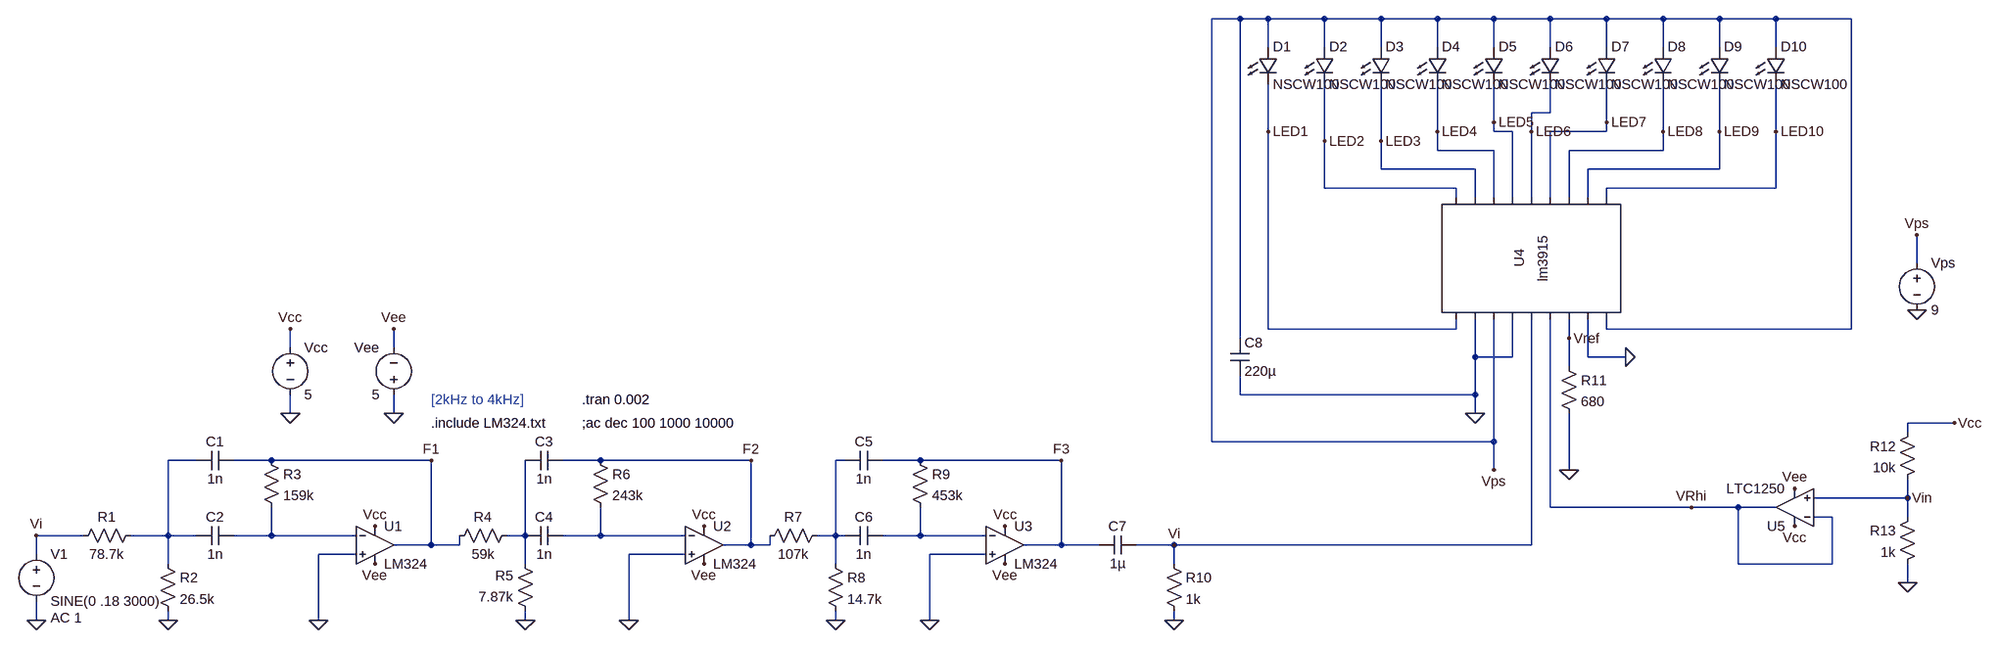
[diagram p0: schematic FinalUpperMidrangeFilterWithLEDDriver.asc]
FinalUpperMidrangeFilterWithLEDDriver.asc, the LTspice schematic file:
Version 4
SHEET 1 2840 680
WIRE 1568 -736 1520 -736
WIRE 1616 -736 1568 -736
WIRE 1712 -736 1616 -736
WIRE 1808 -736 1712 -736
WIRE 1904 -736 1808 -736
WIRE 2000 -736 1904 -736
WIRE 2096 -736 2000 -736
WIRE 2192 -736 2096 -736
WIRE 2288 -736 2192 -736
WIRE 2384 -736 2288 -736
WIRE 2480 -736 2384 -736
WIRE 2608 -736 2480 -736
WIRE 1616 -688 1616 -736
WIRE 1712 -688 1712 -736
WIRE 1808 -688 1808 -736
WIRE 1904 -688 1904 -736
WIRE 2000 -688 2000 -736
WIRE 2096 -688 2096 -736
WIRE 2192 -688 2192 -736
WIRE 2288 -688 2288 -736
WIRE 2384 -688 2384 -736
WIRE 2480 -688 2480 -736
WIRE 2096 -576 2096 -624
WIRE 2096 -576 2064 -576
WIRE 2000 -560 2000 -624
WIRE 2192 -560 2192 -624
WIRE 1616 -544 1616 -624
WIRE 1904 -544 1904 -624
WIRE 2000 -544 2000 -560
WIRE 2032 -544 2000 -544
WIRE 2064 -544 2064 -576
WIRE 2192 -544 2192 -560
WIRE 2192 -544 2096 -544
WIRE 2288 -544 2288 -624
WIRE 2384 -544 2384 -624
WIRE 2480 -544 2480 -624
WIRE 1712 -528 1712 -624
WIRE 1808 -528 1808 -624
WIRE 1904 -512 1904 -544
WIRE 2000 -512 1904 -512
WIRE 2288 -512 2288 -544
WIRE 2288 -512 2128 -512
WIRE 1808 -480 1808 -528
WIRE 1968 -480 1808 -480
WIRE 2384 -480 2384 -544
WIRE 2384 -480 2160 -480
WIRE 1712 -448 1712 -528
WIRE 1936 -448 1712 -448
WIRE 2480 -448 2480 -544
WIRE 2480 -448 2192 -448
WIRE 1936 -432 1936 -448
WIRE 1968 -432 1968 -480
WIRE 2000 -432 2000 -512
WIRE 2032 -432 2032 -544
WIRE 2064 -432 2064 -544
WIRE 2096 -432 2096 -544
WIRE 2128 -432 2128 -512
WIRE 2160 -432 2160 -480
WIRE 2192 -432 2192 -448
WIRE 2720 -320 2720 -368
WIRE 1616 -208 1616 -544
WIRE 1936 -208 1936 -224
WIRE 1936 -208 1616 -208
WIRE 2192 -208 2192 -224
WIRE 2608 -208 2608 -736
WIRE 2608 -208 2192 -208
WIRE 1568 -192 1568 -736
WIRE 2128 -192 2128 -224
WIRE -48 -176 -48 -208
WIRE 128 -176 128 -208
WIRE 1968 -160 1968 -224
WIRE 2032 -160 2032 -224
WIRE 2032 -160 1968 -160
WIRE 2160 -160 2160 -224
WIRE 2224 -160 2160 -160
WIRE 2128 -144 2128 -192
WIRE 1568 -96 1568 -128
WIRE 1968 -96 1968 -160
WIRE 1968 -96 1568 -96
WIRE -48 -64 -48 -96
WIRE 128 -64 128 -96
WIRE 1968 -64 1968 -96
WIRE 2784 -48 2704 -48
WIRE 2704 -32 2704 -48
WIRE 1520 -16 1520 -736
WIRE 2000 -16 2000 -224
WIRE 2000 -16 1520 -16
WIRE -208 16 -256 16
WIRE -80 16 -144 16
WIRE 192 16 -80 16
WIRE 480 16 416 16
WIRE 736 16 480 16
WIRE 896 16 880 16
WIRE 1024 16 960 16
WIRE 1264 16 1024 16
WIRE 2000 32 2000 -16
WIRE 2128 32 2128 -64
WIRE 2704 80 2704 48
WIRE 2704 80 2544 80
WIRE 2096 96 2096 -224
WIRE 2336 96 2096 96
WIRE 2416 96 2336 96
WIRE 2480 96 2416 96
WIRE 2576 112 2544 112
WIRE 2704 112 2704 80
WIRE -400 144 -480 144
WIRE -256 144 -256 16
WIRE -256 144 -320 144
WIRE -208 144 -256 144
WIRE -80 144 -80 96
WIRE -80 144 -144 144
WIRE 64 144 -80 144
WIRE 352 144 352 16
WIRE 352 144 320 144
WIRE 480 144 480 96
WIRE 480 144 416 144
WIRE 624 144 480 144
WIRE 880 144 880 16
WIRE 880 144 848 144
WIRE 896 144 880 144
WIRE 1024 144 1024 96
WIRE 1024 144 960 144
WIRE 1136 144 1024 144
WIRE 192 160 192 16
WIRE 192 160 128 160
WIRE 240 160 240 144
WIRE 240 160 192 160
WIRE 736 160 736 16
WIRE 736 160 688 160
WIRE 768 160 768 144
WIRE 768 160 736 160
WIRE 1264 160 1264 16
WIRE 1264 160 1200 160
WIRE 1328 160 1264 160
WIRE 1456 160 1392 160
WIRE 2064 160 2064 -224
WIRE 2064 160 1456 160
WIRE -480 176 -480 144
WIRE 64 176 0 176
WIRE 624 176 528 176
WIRE 1136 176 1040 176
WIRE -256 192 -256 144
WIRE 352 192 352 144
WIRE 880 192 880 144
WIRE 1456 192 1456 160
WIRE 2416 192 2416 96
WIRE 2576 192 2576 112
WIRE 2576 192 2416 192
WIRE 2704 224 2704 192
WIRE -480 288 -480 256
WIRE -256 288 -256 272
WIRE 0 288 0 176
WIRE 352 288 352 272
WIRE 528 288 528 176
WIRE 880 288 880 272
WIRE 1040 288 1040 176
WIRE 1456 288 1456 272
FLAG 528 288 0
FLAG -480 288 0
FLAG 192 16 F1
FLAG 736 16 F2
FLAG -480 144 Vi
FLAG 1040 288 0
FLAG 1264 16 F3
FLAG 880 288 0
FLAG 352 288 0
FLAG -256 288 0
FLAG 0 288 0
FLAG -48 -208 Vcc
FLAG -48 -64 0
FLAG 128 -64 0
FLAG 128 -208 Vee
FLAG 96 192 Vee
FLAG 96 128 Vcc
FLAG 656 192 Vee
FLAG 656 128 Vcc
FLAG 1168 192 Vee
FLAG 1168 128 Vcc
FLAG 1456 288 0
FLAG 1456 160 Vi
FLAG 1968 -64 0
FLAG 2720 -240 0
FLAG 2720 -368 Vps
FLAG 2128 32 0
FLAG 2000 32 Vps
FLAG 1616 -544 LED1
FLAG 1712 -528 LED2
FLAG 1808 -528 LED3
FLAG 1904 -544 LED4
FLAG 2000 -560 LED5
FLAG 2064 -544 LED6
FLAG 2192 -560 LED7
FLAG 2288 -544 LED8
FLAG 2384 -544 LED9
FLAG 2480 -544 LED10
FLAG 2224 -160 0
FLAG 2128 -192 Vref
FLAG 2704 224 0
FLAG 2512 128 Vcc
FLAG 2704 80 Vin
FLAG 2336 96 VRhi
FLAG 2512 64 Vee
FLAG 2784 -48 Vcc
SYMBOL res -304 128 R90
WINDOW 0 0 56 VBottom 2
WINDOW 3 32 56 VTop 2
SYMATTR InstName R1
SYMATTR Value 78.7k
SYMBOL voltage -480 160 R0
WINDOW 123 24 124 Left 2
WINDOW 39 0 0 Left 0
SYMATTR Value2 AC 1
SYMATTR InstName V1
SYMATTR Value SINE(0 .18 3000)
SYMBOL res -96 0 R0
SYMATTR InstName R3
SYMATTR Value 159k
SYMBOL res 336 128 R90
WINDOW 0 0 56 VBottom 2
WINDOW 3 32 56 VTop 2
SYMATTR InstName R4
SYMATTR Value 59k
SYMBOL res 368 288 R180
WINDOW 0 36 76 Left 2
WINDOW 3 36 40 Left 2
SYMATTR InstName R5
SYMATTR Value 7.87k
SYMBOL res 464 0 R0
SYMATTR InstName R6
SYMATTR Value 243k
SYMBOL res 752 160 R270
WINDOW 0 32 56 VTop 2
WINDOW 3 0 56 VBottom 2
SYMATTR InstName R7
SYMATTR Value 107k
SYMBOL res 864 176 R0
SYMATTR InstName R8
SYMATTR Value 14.7k
SYMBOL res 1008 0 R0
SYMATTR InstName R9
SYMATTR Value 453k
SYMBOL cap -144 0 R90
WINDOW 0 0 32 VBottom 2
WINDOW 3 32 32 VTop 2
SYMATTR InstName C1
SYMATTR Value 1n
SYMBOL cap -144 128 R90
WINDOW 0 0 32 VBottom 2
WINDOW 3 32 32 VTop 2
SYMATTR InstName C2
SYMATTR Value 1n
SYMBOL cap 416 0 R90
WINDOW 0 0 32 VBottom 2
WINDOW 3 32 32 VTop 2
SYMATTR InstName C3
SYMATTR Value 1n
SYMBOL cap 416 128 R90
WINDOW 0 0 32 VBottom 2
WINDOW 3 32 32 VTop 2
SYMATTR InstName C4
SYMATTR Value 1n
SYMBOL cap 960 0 R90
WINDOW 0 0 32 VBottom 2
WINDOW 3 32 32 VTop 2
SYMATTR InstName C5
SYMATTR Value 1n
SYMBOL cap 960 128 R90
WINDOW 0 0 32 VBottom 2
WINDOW 3 32 32 VTop 2
SYMATTR InstName C6
SYMATTR Value 1n
SYMBOL res -272 176 R0
SYMATTR InstName R2
SYMATTR Value 26.5k
SYMBOL voltage -48 -192 R0
WINDOW 123 0 0 Left 0
WINDOW 39 0 0 Left 0
SYMATTR InstName Vcc
SYMATTR Value 5
SYMBOL voltage 128 -80 R180
WINDOW 0 24 96 Left 2
WINDOW 3 24 16 Left 2
WINDOW 123 0 0 Left 0
WINDOW 39 0 0 Left 0
SYMATTR InstName Vee
SYMATTR Value 5
SYMBOL OpAmps\\opamp2 96 96 R0
SYMATTR InstName U1
SYMATTR Value LM324
SYMBOL OpAmps\\opamp2 656 96 R0
SYMATTR InstName U2
SYMATTR Value LM324
SYMBOL OpAmps\\opamp2 1168 96 R0
SYMATTR InstName U3
SYMATTR Value LM324
SYMBOL cap 1392 144 R90
WINDOW 0 0 32 VBottom 2
WINDOW 3 32 32 VTop 2
SYMATTR InstName C7
SYMATTR Value 1µ
SYMBOL res 1440 176 R0
SYMATTR InstName R10
SYMATTR Value 1k
SYMBOL LED 1600 -688 R0
SYMATTR InstName D1
SYMATTR Value NSCW100
SYMBOL LED 1696 -688 R0
SYMATTR InstName D2
SYMATTR Value NSCW100
SYMBOL LED 1792 -688 R0
SYMATTR InstName D3
SYMATTR Value NSCW100
SYMBOL LED 1888 -688 R0
SYMATTR InstName D4
SYMATTR Value NSCW100
SYMBOL LED 1984 -688 R0
SYMATTR InstName D5
SYMATTR Value NSCW100
SYMBOL LED 2080 -688 R0
SYMATTR InstName D6
SYMATTR Value NSCW100
SYMBOL LED 2176 -688 R0
SYMATTR InstName D7
SYMATTR Value NSCW100
SYMBOL LED 2272 -688 R0
SYMATTR InstName D8
SYMATTR Value NSCW100
SYMBOL LED 2368 -688 R0
SYMATTR InstName D9
SYMATTR Value NSCW100
SYMBOL LED 2464 -688 R0
SYMATTR InstName D10
SYMATTR Value NSCW100
SYMBOL cap 1552 -192 R0
SYMATTR InstName C8
SYMATTR Value 220µ
SYMBOL voltage 2720 -336 R0
WINDOW 123 0 0 Left 0
WINDOW 39 0 0 Left 0
SYMATTR InstName Vps
SYMATTR Value 9
SYMBOL AutoGenerated\\lm3915 2064 -320 R270
SYMATTR InstName U4
SYMBOL res 2112 -160 R0
SYMATTR InstName R11
SYMATTR Value 680
SYMBOL res 2720 -48 M0
SYMATTR InstName R12
SYMATTR Value 10k
SYMBOL res 2720 96 M0
SYMATTR InstName R13
SYMATTR Value 1k
SYMBOL OpAmps\\LTC1250 2512 160 R180
SYMATTR InstName U5
TEXT 448 -88 Left 2 !.tran 0.002
TEXT 448 -48 Left 2 !;ac dec 100 1000 10000
TEXT 192 -88 Left 2 ;[2kHz to 4kHz]
TEXT 192 -48 Left 2 !.include LM324.txt

The netlist it stands for:
* FinalUpperMidrangeFilterWithLEDDriver.asc
R1 N001 Vi 78.7k
V1 Vi 0 SINE(0 .18 3000) AC 1
R3 F1 N003 159k
R4 N004 F1 59k
R5 0 N004 7.87k
R6 F2 N005 243k
R7 F2 N002 107k
R8 N002 0 14.7k
R9 F3 N006 453k
C1 F1 N001 1n
C2 N003 N001 1n
C3 F2 N004 1n
C4 N005 N004 1n
C5 F3 N002 1n
C6 N006 N002 1n
R2 N001 0 26.5k
Vcc Vcc 0 5
Vee 0 Vee 5
XU1 0 N003 Vcc Vee F1 LM324  ; pins In+ In- V+ V- OUT
XU2 0 N005 Vcc Vee F2 LM324  ; pins In+ In- V+ V- OUT
XU3 0 N006 Vcc Vee F3 LM324  ; pins In+ In- V+ V- OUT
C7 Vi F3 1µ
R10 Vi 0 1k
D1 Vps LED1 NSCW100
D2 Vps LED2 NSCW100
D3 Vps LED3 NSCW100
D4 Vps LED4 NSCW100
D5 Vps LED5 NSCW100
D6 Vps LED6 NSCW100
D7 Vps LED7 NSCW100
D8 Vps LED8 NSCW100
D9 Vps LED9 NSCW100
D10 Vps LED10 NSCW100
C8 Vps 0 220µ
Vps Vps 0 9
* U4: lm3915 (symbol AutoGenerated\lm3915 not available, pins judged from their places): pin1=LED1 pin2=0 pin3=Vps pin4=0 pin5=Vi pin6=VRhi pin7=Vref pin8=0 pin9=Vps pin10=LED2 pin11=LED3 pin12=LED4 pin13=LED5 pin14=LED6 pin15=LED7 pin16=LED8 pin17=LED9 pin18=LED10
R11 Vref 0 680
R12 Vcc Vin 10k
R13 Vin 0 1k
XU5 Vin VRhi Vcc Vee VRhi LTC1250  ; pins In+ In- V+ V- OUT
.model D D
.lib standard.dio
.tran 0.002
;ac dec 100 1000 10000
* [2kHz to 4kHz]
.include LM324.txt
.backanno
.end